# EAGLE design PIC32_breakout (EAGLE 9.4.2)
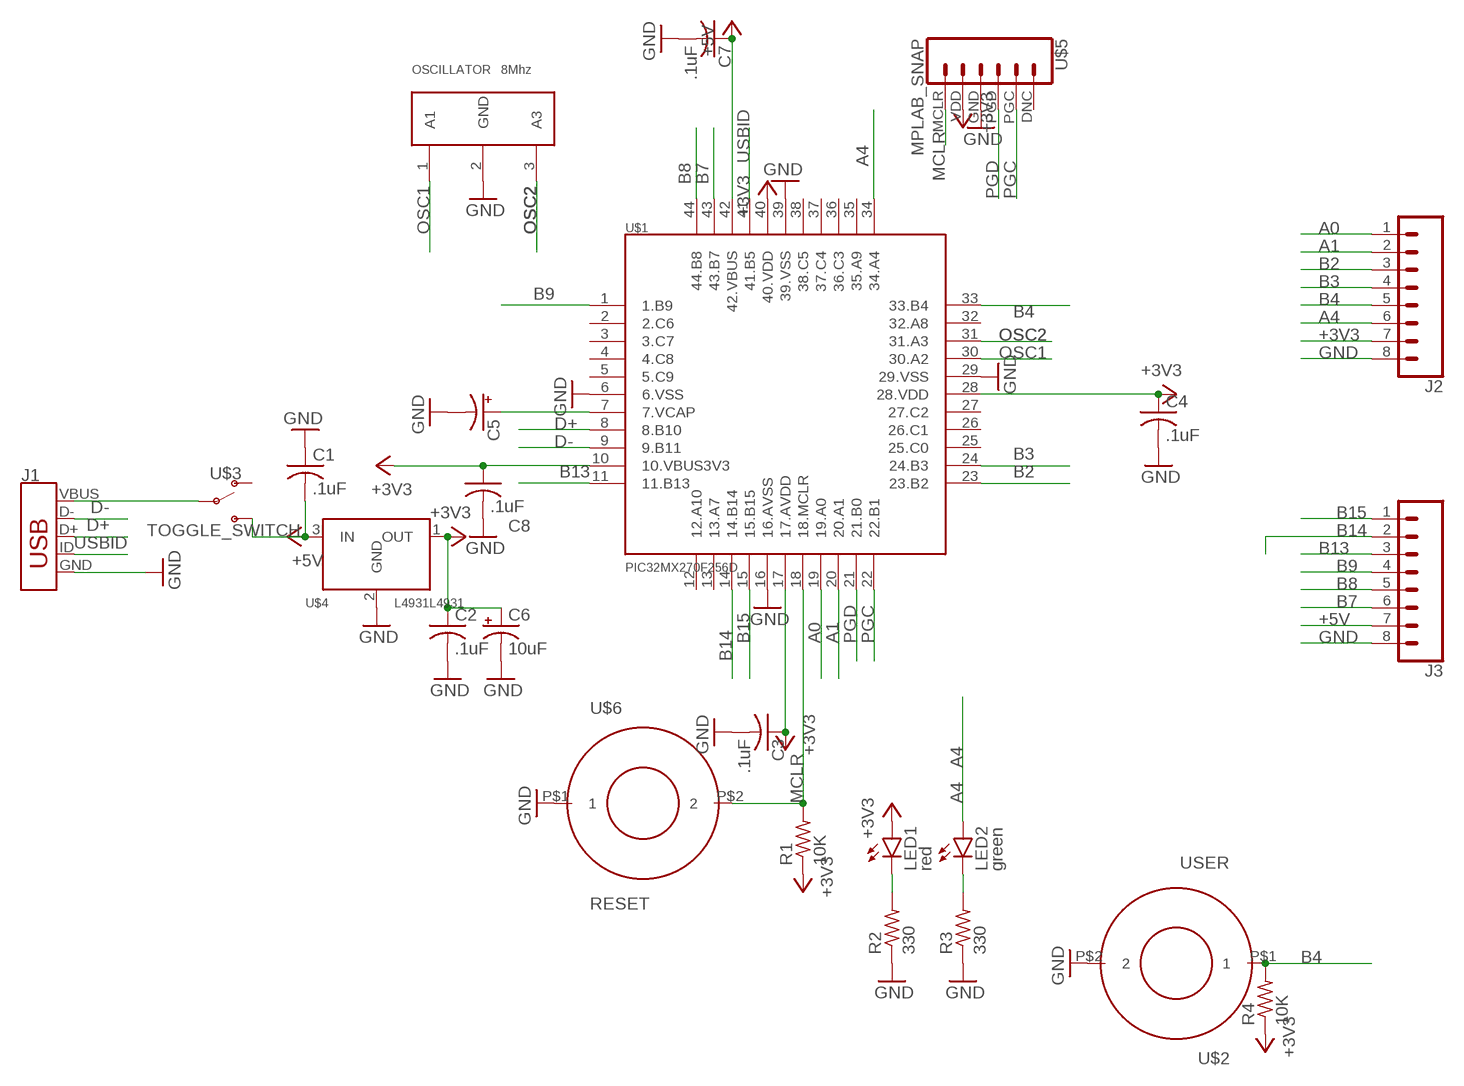
[diagram p0: schematic, sheet 1]

## Parts
C1  .1uF  C-US025-025X050  [C025-025X050]
C2  .1uF  C-US025-025X050  [C025-025X050]
C3  .1uF  C-US025-025X050  [C025-025X050]
C4  .1uF  C-US025-025X050  [C025-025X050]
C5  CPOL-USB45181B  [B45181B]
C6  10uF  CPOL-USB45181B  [B45181B]
C7  .1uF  C-US025-025X050  [C025-025X050]
C8  .1uF  C-US025-025X050  [C025-025X050]
J1  USB_MICRO-B  [AMPHENOL609-4618-1-ND]
J2  CONN_08"  [1X08]
J3  CONN_08"  [1X08]
LED1  red  LED3MM  [LED3MM]
LED2  green  LED3MM  [LED3MM]
OSCILLATOR  8Mhz  RESONATOR  [1X03]
R1  10K  R-US_0207/10  [0207/10]
R2  330  R-US_0207/10  [0207/10]
R3  330  R-US_0207/10  [0207/10]
R4  10K  R-US_0207/10  [0207/10]
U$1  PIC32MX270F256D  [TQFP44]
U$2  USER  SWITCH_BTN_NO  [BTN_2]
U$3  TOGGLE_SWITCH  [TOGGLE]
U$4  L4931L4931  [TO92]
U$5  MPLAB_SNAP  [1X06]
U$6  RESET  SWITCH_BTN_NO  [BTN_2]

## Nets
+3V3: C2.1 C3.1 C4.1 C6.+ C8.1 J2.7 LED1.A R1.1 R4.1 U$1.10(10.VBUS3V3) U$1.17(17.AVDD) U$1.28(28.VDD) U$1.40(40.VDD) U$4.1(OUT) U$5.VDD
+5V: C1.2 C7.1 J3.7 U$1.42(42.VBUS) U$3.P$3(OUT2) U$4.3(IN)
A0: J2.1 U$1.19(19.A0)
A1: J2.2 U$1.20(20.A1)
A4: J2.6 LED2.A U$1.34(34.A4)
B2: J2.3 U$1.23(23.B2)
B3: J2.4 U$1.24(24.B3)
B4: J2.5 R4.2 U$1.33(33.B4) U$2.P$1
B7: J3.6 U$1.43(43.B7)
B8: J3.5 U$1.44(44.B8)
B9: J3.4 U$1.1(1.B9)
B13: J3.3 U$1.11(11.B13)
B14: J3.2 U$1.14(14.B14)
B15: J3.1 U$1.15(15.B15)
D+: J1.D+ U$1.8(8.B10)
D-: J1.D- U$1.9(9.B11)
GND: C1.1 C2.2 C3.2 C4.2 C5.- C6.- C7.2 C8.2 J1.GND J2.8 J3.8 OSCILLATOR.2(GND) R2.1 R3.1 U$1.6(6.VSS) U$1.16(16.AVSS) U$1.29(29.VSS) U$1.39(39.VSS) U$2.P$2 U$4.2(GND) U$5.GND U$6.P$1
MCLR: R1.2 U$1.18(18.MCLR) U$5.MCLR U$6.P$2
N$1: LED1.K(C) R2.2
N$2: LED2.K(C) R3.2
N$3: J1.VBUS U$3.P$1(IN)
N$9: C5.+ U$1.7(7.VCAP)
OSC1: OSCILLATOR.1(A1) U$1.30(30.A2)
OSC2: OSCILLATOR.3(A3) U$1.31(31.A3)
PGC: U$1.22(22.B1) U$5.PGC
PGD: U$1.21(21.B0) U$5.PGD
USBID: J1.ID U$1.41(41.B5)
Unconnected: U$1.2(2.C6) U$1.3(3.C7) U$1.4(4.C8) U$1.5(5.C9) U$1.12(12.A10) U$1.13(13.A7) U$1.25(25.C0) U$1.26(26.C1) U$1.27(27.C2) U$1.32(32.A8) U$1.35(35.A9) U$1.36(36.C3) U$1.37(37.C4) U$1.38(38.C5) U$3.P$2(OUT1) U$5.DNC

## Library data of the parts
C1-C4 C7 C8 = mechE433:C-US: CAPACITOR, American symbol; SPICEPREFIX: C
C5 C6 = mechE433:CPOL-US: POLARIZED CAPACITOR, American symbol; SPICEPREFIX: C
J1 = mechE433:USB_MICRO-B: USB Type Micro-B Connector Male/female and PTH/SMT variants SparkFun Products: SparkFun microB USB Breakout <https://www.sparkfun.com/products/12035> SparkFun USB microB Plug Breakout <https://www.sparkfun.com/products/10031> SparkFun ESP8266 Thing <https://www.sparkfun.com/products/13231>
J2 J3 = mechE433:CONN_08: Multi connection point. Often used as Generic Header-pin footprint for 0.1 inch spaced/style header connections On any of the 0.1 inch spaced packages, you can populate with these: Break Away Headers - Straight <https://www.sparkfun.com/products/116> (PRT-00116) Break Away Male Headers - Right Angle <https://www.sparkfun.com/products/553> (PRT-00553) Female Headers <https://www.sparkfun.com/products/115> (PRT-00115) Break Away Headers - Machine Pin <https://www.sparkfun.com/products/117> (PRT-00117) Break Away Female Headers - Swiss Machine Pin <https://www.sparkfun.com/products/743> (PRT-00743) Arduino Stackable Header - 8 Pin <https://www.sparkfun.com/products/9279> (PRT-09279) For SCREWTERMINALS and SPRING TERMINALS visit here: Screw Terimnals on SparkFun.com <https://www.sparkfun.com/search/results?term=Screw+Terminals> (5mm/3.5mm/2.54mm spacing) This device is also useful as a general connection point to wire up your design to another part of your project. Our various solder wires solder well into these plated through hole pads. Hook-Up Wire - Assortment (Stranded, 22 AWG) <https://www.sparkfun.com/products/11375> (PRT-11375) Hook-Up Wire - Assortment (Solid Core, 22 AWG) <https://www.sparkfun.com/products/11367> (PRT-11367) View the entire wire category on our website here <https://www.sparkfun.com/categories/141> Special notes: Molex polarized connector foot print use with SKU : PRT-08231 with associated crimp pins and housings. 1MM SMD Version SKU: PRT-10208 NOTES ON THE VARIANTS LOCK and LOCK_LONGPADS... This footprint was designed to help hold the alignment of a through-hole component (i.e. 6-pin header) while soldering it into place. You may notice that each hole has been shifted either up or down by 0.005 of an inch from it's more standard position (which is a perfectly straight line). This slight alteration caused the pins (the squares in the middle) to touch the edges of the holes. Because they are alternating, it causes a "brace" to hold the component in place. 0.005 has proven to be the perfect amount of "off-center" position when using our standard breakaway headers. Although looks a little odd when you look at the bare footprint, once you have a header in there, the alteration is very hard to notice. Also,if you push a header all the way into place, it is covered up entirely on the bottom side.; PROD_ID: CONN-08438
LED1 LED2 = mechE433:LED: LED OSRAM: - CHIPLED LG R971, LG N971, LY N971, LG Q971, LY Q971, LO R971, LY R971 LH N974, LH R974 LS Q976, LO Q976, LY Q976 LO Q996 - Hyper CHIPLED LW Q18S LB Q993, LB Q99A, LB R99A - SideLED LS A670, LO A670, LY A670, LG A670, LP A670 LB A673, LV A673, LT A673, LW A673 LH A674 LY A675 LS A676, LA A676, LO A676, LY A676, LW A676 LS A679, LY A679, LG A679 - Hyper Micro SIDELED® LS Y876, LA Y876, LO Y876, LY Y876 LT Y87S - SmartLED LW L88C, LW L88S LB L89C, LB L89S, LG L890 LS L89K, LO L89K, LY L89K LS L896, LA L896, LO L896, LY L896 - TOPLED LS T670, LO T670, LY T670, LG T670, LP T670 LSG T670, LSP T670, LSY T670, LOP T670, LYG T670 LG T671, LOG T671, LSG T671 LB T673, LV T673, LT T673, LW T673 LH T674 LS T676, LA T676, LO T676, LY T676, LB T676, LH T676, LSB T676, LW T676 LB T67C, LV T67C, LT T67C, LS T67K, LO T67K, LY T67K, LW E67C LS E67B, LA E67B, LO E67B, LY E67B, LB E67C, LV E67C, LT E67C LW T67C LS T679, LY T679, LG T679 LS T770, LO T770, LY T770, LG T770, LP T770 LB T773, LV T773, LT T773, LW T773 LH T774 LS E675, LA E675, LY E675, LS T675 LS T776, LA T776, LO T776, LY T776, LB T776 LHGB T686 LT T68C, LB T68C - Hyper Mini TOPLED® LB M676 - Mini TOPLED Santana® LG M470 LS M47K, LO M47K, LY M47K Source: http://www.osram.convergy.de LUXEON: - LUMILED® LXK2-PW12-R00, LXK2-PW12-S00, LXK2-PW14-U00, LXK2-PW14-V00 LXK2-PM12-R00, LXK2-PM12-S00, LXK2-PM14-U00 LXK2-PE12-Q00, LXK2-PE12-R00, LXK2-PE12-S00, LXK2-PE14-T00, LXK2-PE14-U00 LXK2-PB12-K00, LXK2-PB12-L00, LXK2-PB12-M00, LXK2-PB14-N00, LXK2-PB14-P00, LXK2-PB14-Q00 LXK2-PR12-L00, LXK2-PR12-M00, LXK2-PR14-Q00, LXK2-PR14-R00 LXK2-PD12-Q00, LXK2-PD12-R00, LXK2-PD12-S00 LXK2-PH12-R00, LXK2-PH12-S00 LXK2-PL12-P00, LXK2-PL12-Q00, LXK2-PL12-R00 Source: www.luxeon.com KINGBRIGHT: KA-3528ASYC Source: www.kingbright.com
OSCILLATOR = mechE433:RESONATOR
R1-R4 = mechE433:R-US_: RESISTOR, American symbol; SPICEPREFIX: R
U$1 = mechE433:PIC32MX270F256D
U$2 U$6 = mechE433:SWITCH_BTN_NO
U$3 = mechE433:TOGGLE_SWITCH
U$4 = mechE433:L4931
U$5 = mechE433:MPLAB_SNAP

## Board
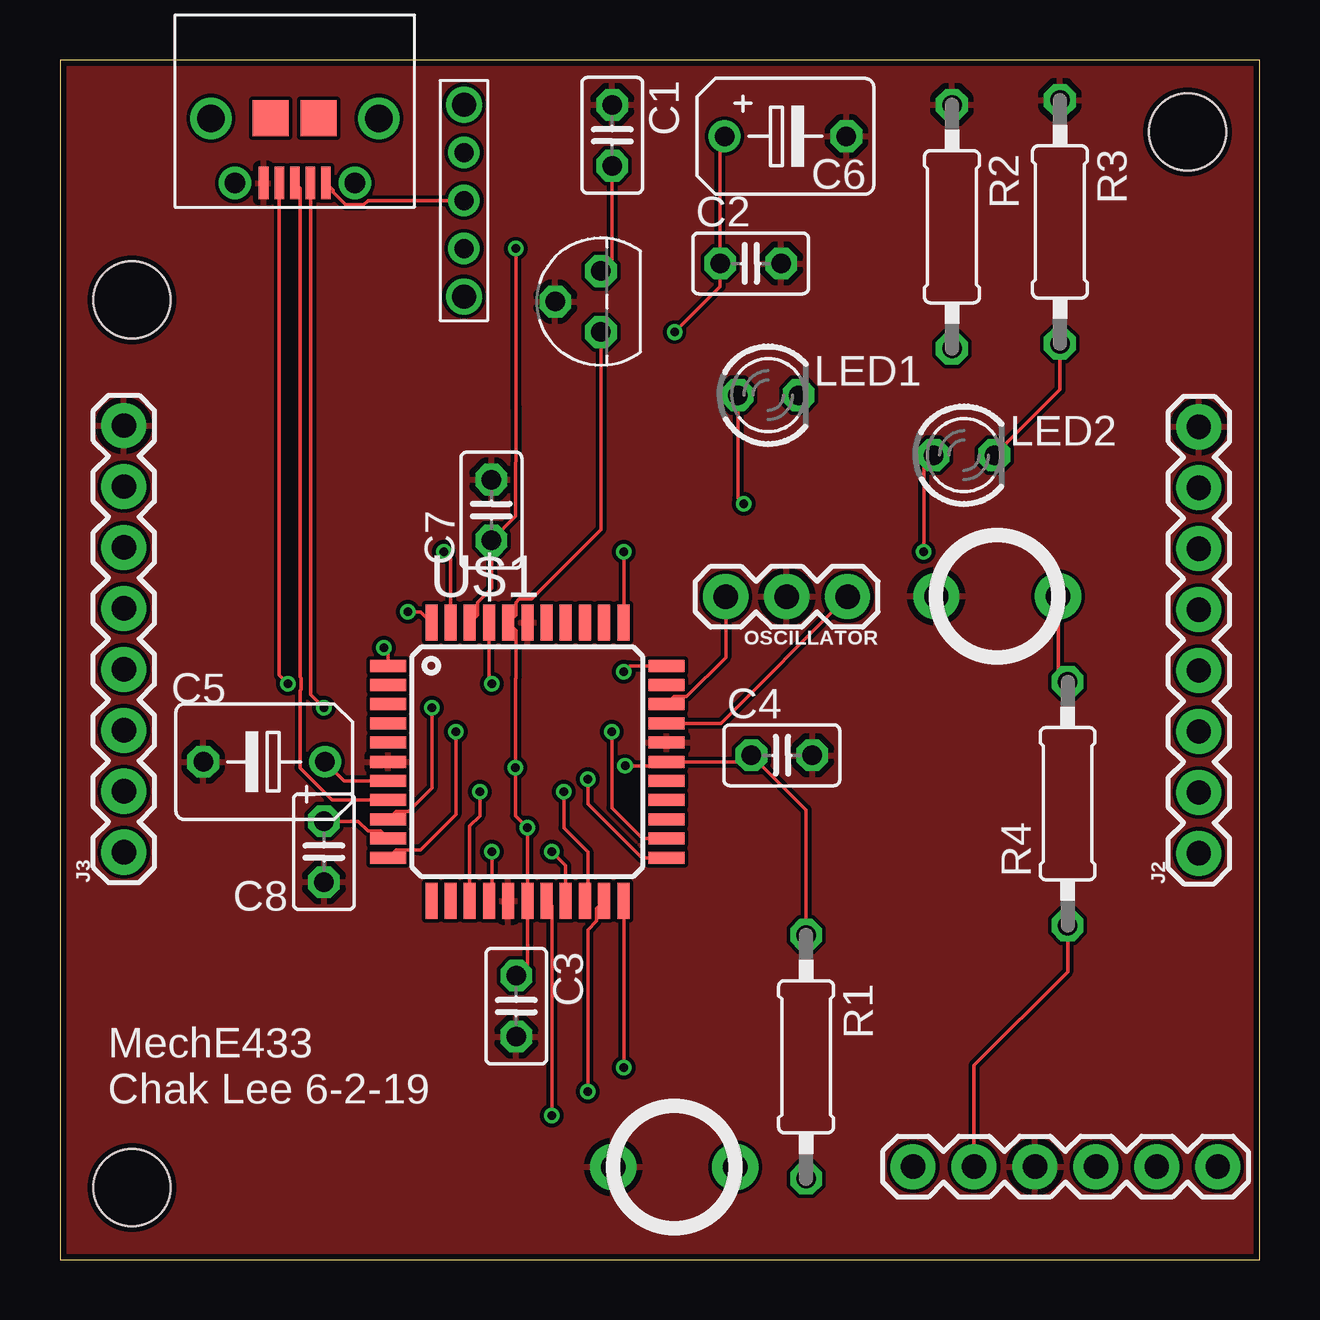
[diagram p1: board, top side]
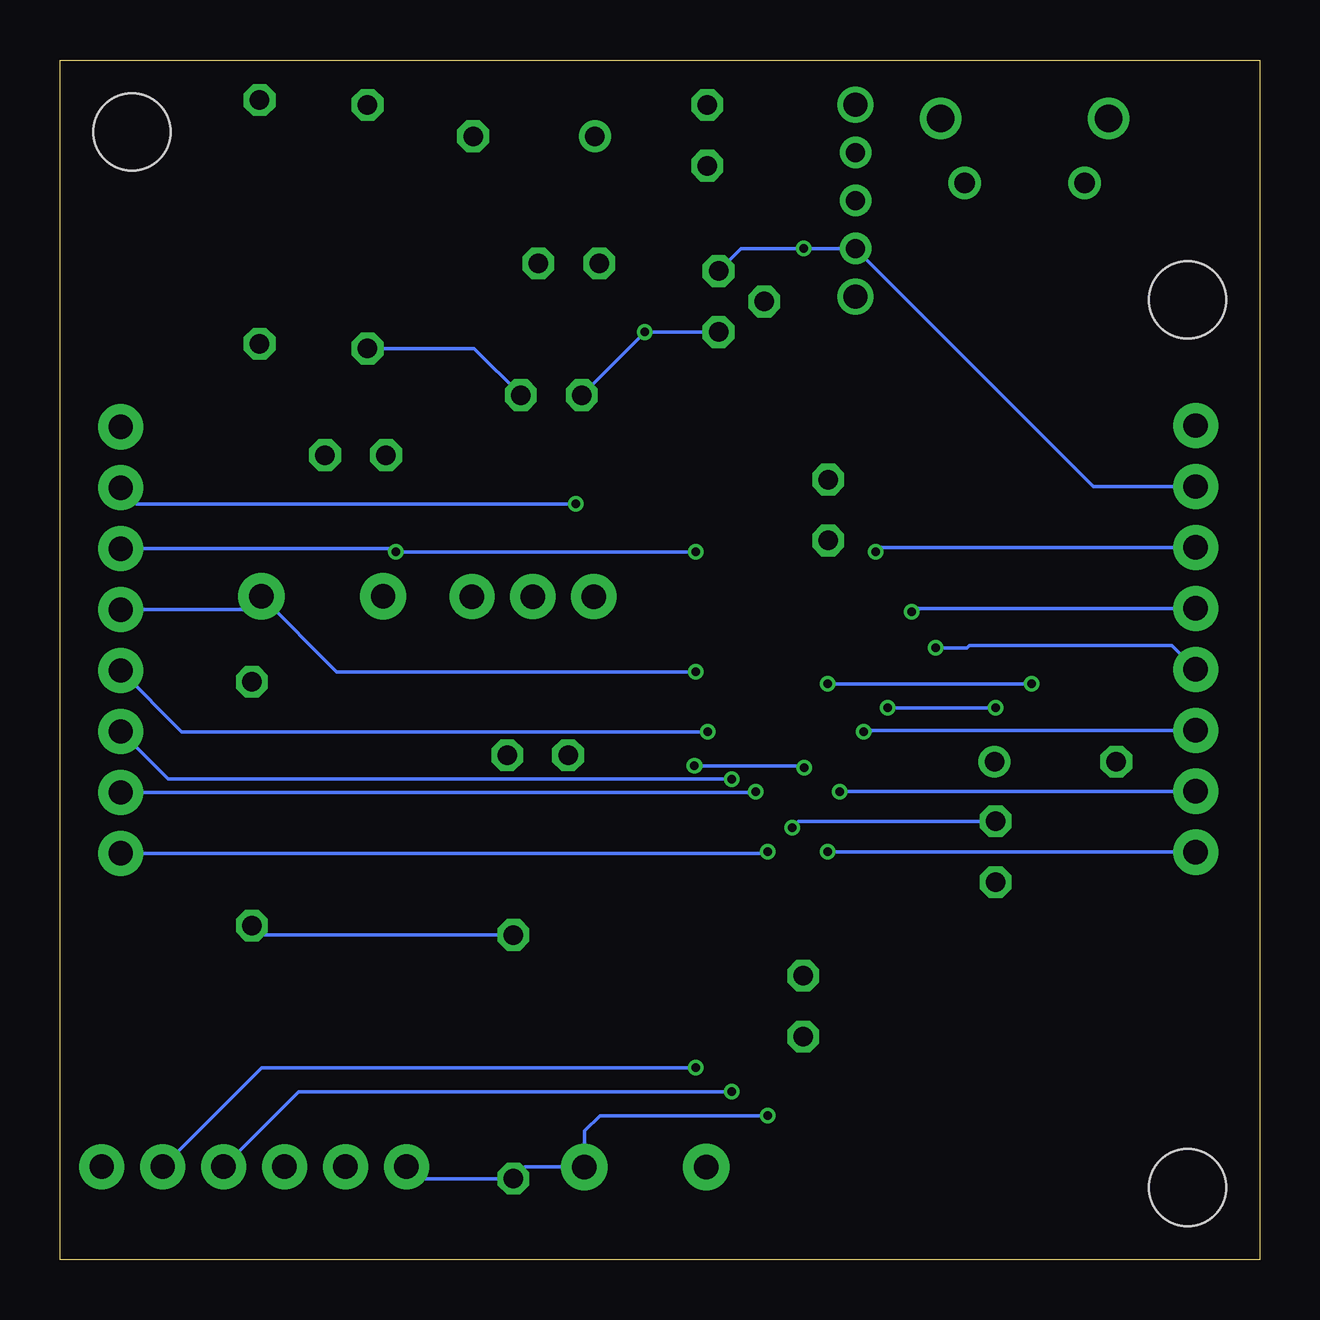
[diagram p2: board, bottom side, seen from below]

Size 50 x 50 mm. Coordinates in mm from the lower left corner, seen from the top.
Outline: 0,0 50,0 50,50 0,50 0,0
Copper layers (1*16): Top 0.035mm / dielectric 1.5mm / Bottom 0.035mm
Design rules "SeeedStudio_2layer_DRU_no_angle_20140221": minimum track width 6mil, minimum drill 12mil, track to track 6mil, track to pad 6mil, pad to pad 6mil, via to via 6mil, smd to smd 0mil, copper to edge 10mil, drill to drill 10mil, minimum pad ring 10mil, minimum via ring 6mil, stop-mask expansion 2mil, vias tented up to drill 100mil, thermal gap 10mil
Holes 3.2 mm at 47,47 3,40 3,3

### Footprints (pad centres in the part's own frame; a part is rotated, then mirrored left to right if it is on the bottom)
C025-025X050 = drill 0.813 octagon: 1 -1.27,0; 2 1.27,0
B45181B = drill 0.813: + -2.54,0 | drill 0.813 octagon: - 2.54,0
AMPHENOL609-4618-1-ND = smd 0.4 x 1.35: D+ 0,0; D- -0.65,0; GND 1.3,0; ID 0.65,0; VBUS -1.3,0 | drill 0.85 pad 1.25: P$6 -2.5,0; P$7 2.5,0 | drill 1.15 pad 1.55: P$8 3.5,-2.7; P$9 -3.5,-2.7 | smd 1.5 x 1.5: P$10 -1,-2.7; P$11 1,-2.7
1X08 = drill 1.016 pad 1.88: 1 0,0; 2 2.54,0; 3 5.08,0; 4 7.62,0; 5 10.16,0; 6 12.7,0; 7 15.24,0; 8 17.78,0
LED3MM = drill 0.813 octagon: A -1.27,0; K 1.27,0
1X03 = drill 1.016 pad 1.88: 1 0,0; 2 2.54,0; 3 5.08,0
0207/10 = drill 0.813 octagon: 1 -5.08,0; 2 5.08,0
TQFP44 = smd 1.5 x 0.5: 1 -5.8,4; 2 -5.8,3.2; 3 -5.8,2.4; 4 -5.8,1.6; 5 -5.8,0.8; 6 -5.8,0; 7 -5.8,-0.8; 8 -5.8,-1.6; 9 -5.8,-2.4; 10 -5.8,-3.2; 11 -5.8,-4; 23 5.8,-4; 24 5.8,-3.2; 25 5.8,-2.4; 26 5.8,-1.6; 27 5.8,-0.8; 28 5.8,0; 29 5.8,0.8; 30 5.8,1.6; 31 5.8,2.4; 32 5.8,3.2; 33 5.8,4 | smd 0.5 x 1.5: 12 -4,-5.8; 13 -3.2,-5.8; 14 -2.4,-5.8; 15 -1.6,-5.8; 16 -0.8,-5.8; 17 0,-5.8; 18 0.8,-5.8; 19 1.6,-5.8; 20 2.4,-5.8; 21 3.2,-5.8; 22 4,-5.8; 34 4,5.8; 35 3.2,5.8; 36 2.4,5.8; 37 1.6,5.8; 38 0.8,5.8; 39 0,5.8; 40 -0.8,5.8; 41 -1.6,5.8; 42 -2.4,5.8; 43 -3.2,5.8; 44 -4,5.8
BTN_2 = drill 1.016 pad 1.93: P$1 -2.54,0; P$2 2.54,0
TOGGLE = drill 0.8: P$1 0,0; P$2 -2,0; P$3 2,0 | drill 1: P$4 4,0; P$5 -4,0
TO92 = drill 0.813 octagon: 1 -1.27,0; 2 0,1.905; 3 1.27,0
1X06 = drill 1.016 pad 1.88: DNC 12.7,0; GND 5.08,0; MCLR 0,0; PGC 10.16,0; PGD 7.62,0; VDD 2.54,0

### Placement (x,y rotation side)
C1  23.02,46.86 270 top
C2  28.79,41.52 0 top
C3  19.02,10.56 270 top
C4  30.09,21.02 0 top
C5  8.51,20.75 180 top
C6  30.24,46.82 0 top
C7  17.98,31.24 90 top
C8  11,17 270 top
J1  9.79,44.87 180 top
J2  47.47,16.93 90 top
J3  2.66,16.98 90 top
LED1  29.52,36.03 0 top
LED2  37.68,33.53 0 top
OSCILLATOR  32.83,27.63 180 top
R1  31.1,8.45 270 top
R2  37.18,43.05 270 top
R3  41.68,43.25 270 top
R4  42,19 90 top
U$1  19.48,20.75 0 top
U$2  39.07,27.65 180 top
U$3  16.84,44.14 270 top
U$4  22.55,39.93 90 top
U$5  35.56,3.87 0 top
U$6  25.6,3.86 0 top

### Tracks (layer width: path | path; a pad name or v marks a point on that pad's centre or on a via)
+3V3  (via drill 0.35)
  Top 0.152: C3.1 19.48,12.29 U$1.17 v19.48,18 18.98,18.5 v18.98,20.5 18.98,24.23 19,24.25 19,26.23 U$1.40 19,26.87 19,27.39 19.14,27.53 19.66,27.53 22.55,30.42 U$4.1 | v25.62,38.66 27.52,40.56 C2.1 27.52,46.64 C6.+ | R1.1 31.1,18.74 C4.1 28.55,20.75 U$1.28 25.11,20.58 v23.56,20.58 | R4.1 42,12 38.1,8.1 U$5.VDD | LED1.A 28.25,31.75 v28.5,31.5 | U$1.10 13.36,17.87 12.84,17.87 12.44,18.27 C8.1
  Bottom 0.152: U$4.1 v25.62,38.66 LED1.A | R1.1 41.61,13.53 R4.1 | v28.5,31.5 46.8,31.5 J2.7 | C8.1 19.21,18.27 v19.48,18 | v23.56,20.58 19.06,20.58 v18.98,20.5
+5V  (via drill 0.35)
  Top 0.152: C1.2 23.02,41.67 U$4.3 | v19,42.14 19,35.5 19.02,35.52 18.99,30.98 C7.1 17.98,27.97 17.4,27.39 17.4,26.87 U$1.42
  Bottom 0.152: J3.7 6.92,32.22 U$3.P$3 v19,42.14 21.61,42.14 U$4.3
A0  (via drill 0.35)
  Top 0.152: v20.5,17 21.08,16.42 U$1.19
  Bottom 0.152: J2.1 20.57,16.93 v20.5,17
A1  (via drill 0.35)
  Top 0.152: v21,19.5 21,18 22,17 22,15.07 U$1.20
  Bottom 0.152: J2.2 21.03,19.47 v21,19.5
A4  (via drill 0.35)
  Top 0.152: v36,29.5 36,33.12 LED2.A | v23.5,29.5 23.5,26.57 U$1.34
  Bottom 0.152: J2.6 36.13,29.63 v36,29.5 v23.5,29.5
B2  (via drill 0.35)
  Top 0.152: v22,20.03 22,19 24.25,16.75 U$1.23
  Bottom 0.152: J2.3 45.49,20.03 v22,20.03
B3  (via drill 0.35)
  Top 0.152: v23,22 23,18.83 24.28,17.55 U$1.24
  Bottom 0.152: J2.4 44.92,22 v23,22
B4  (via drill 0.35)
  Top 0.152: U$2.P$1 41.61,24.47 R4.2 | v23.5,24.5 23.75,24.75 U$1.33
  Bottom 0.152: J2.5 42.17,27.09 U$2.P$1 38.46,24.5 v23.5,24.5
B7  (via drill 0.35)
  Top 0.152: v16,29.5 16.28,29.22 U$1.43
  Bottom 0.152: J3.6 15.82,29.68 v16,29.5
B8  (via drill 0.35)
  Top 0.152: v14.5,27 15.03,27 U$1.44
  Bottom 0.152: J3.5 14.36,27.14 v14.5,27
B9  (via drill 0.35)
  Top 0.152: v13.5,25.5 13.68,25.32 U$1.1
  Bottom 0.152: v13.5,25.5 12.2,25.5 12.1,25.6 3.66,25.6 J3.4
B13  (via drill 0.35)
  Top 0.152: U$1.11 14,17.07 15.03,17.07 16.5,18.55 v16.5,22
  Bottom 0.152: J3.3 16.44,22.06 v16.5,22
B14  (via drill 0.35)
  Top 0.152: v17.5,19.5 17.5,18.5 17.08,18.08 U$1.14
  Bottom 0.152: J3.2 17.48,19.52 v17.5,19.5
B15  (via drill 0.35)
  Top 0.152: v18,17 18,15.07 U$1.15
  Bottom 0.152: J3.1 17.98,16.98 v18,17
D+
  Top 0.152: J1.D+ 10,44.66 10,24.29 10.06,24.23 10.06,23.77 10,23.71 10,20.5 11.35,19.15 U$1.8
D-  (via drill 0.35)
  Top 0.152: J1.D- 10.44,23.56 v11,23 | v15.5,23 15.5,19.65 14.53,18.67 14,18.67 U$1.9
  Bottom 0.152: v11,23 v15.5,23
GND
  pour Top: 0,50 50,50 50,0 0,0
MCLR  (via drill 0.35)
  Top 0.152: v20.5,6 20.5,14.73 U$1.18
  Bottom 0.152: v20.5,6 27.5,6 28.14,5.36 U$6.P$2 30.61,3.86 R1.2 35.06,3.37 U$5.MCLR
N$1
  Bottom 0.152: LED1.K 32.73,37.97 R2.2
N$2
  Top 0.152: R3.2 41.68,36.26 LED2.K
N$3
  Top 0.152: J1.VBUS 11.38,44.58 11.38,44.49 11.91,43.96 12.67,43.96 12.84,44.14 U$3.P$1
N$9
  Top 0.152: U$1.7 11.85,19.95 C5.+
OSC1
  Top 0.152: OSCILLATOR.1 27.55,22.35 U$1.30
OSC2
  Top 0.152: U$1.31 25.6,23.47 26.12,23.47 27.75,25.1 OSCILLATOR.3
PGC  (via drill 0.35)
  Top 0.152: v23.5,8 23.5,14.93 U$1.22
  Bottom 0.152: U$5.PGC 41.59,8 v23.5,8
PGD  (via drill 0.35)
  Top 0.152: U$1.21 22.36,14.63 22.36,14.11 22,13.75 v22,7
  Bottom 0.152: U$5.PGD 40.05,7 v22,7
USBID  (via drill 0.35)
  Top 0.152: J1.ID 9.14,24.36 v9.5,24 | v18,24 17.88,24.12 U$1.41
  Bottom 0.152: v9.5,24 v18,24

### Text on the board
tPlace: MechE433 / Chak Lee 6-2-19